# Altium schematic sheet Underground_Assembly.SchDoc: <Document>
size Letter; Engineer: <Engineer>; Organization: UPEL; Address1: USU Power Electronics Lab; Address2: USTAR Building 620, RM 118; Address3: 1600 N 620 E; Address4: North Logan, UT 84341; DocumentNumber: 11; Revision: v1; SheetNumber: 11; SheetTotal: 16; ProjectName: <Project>
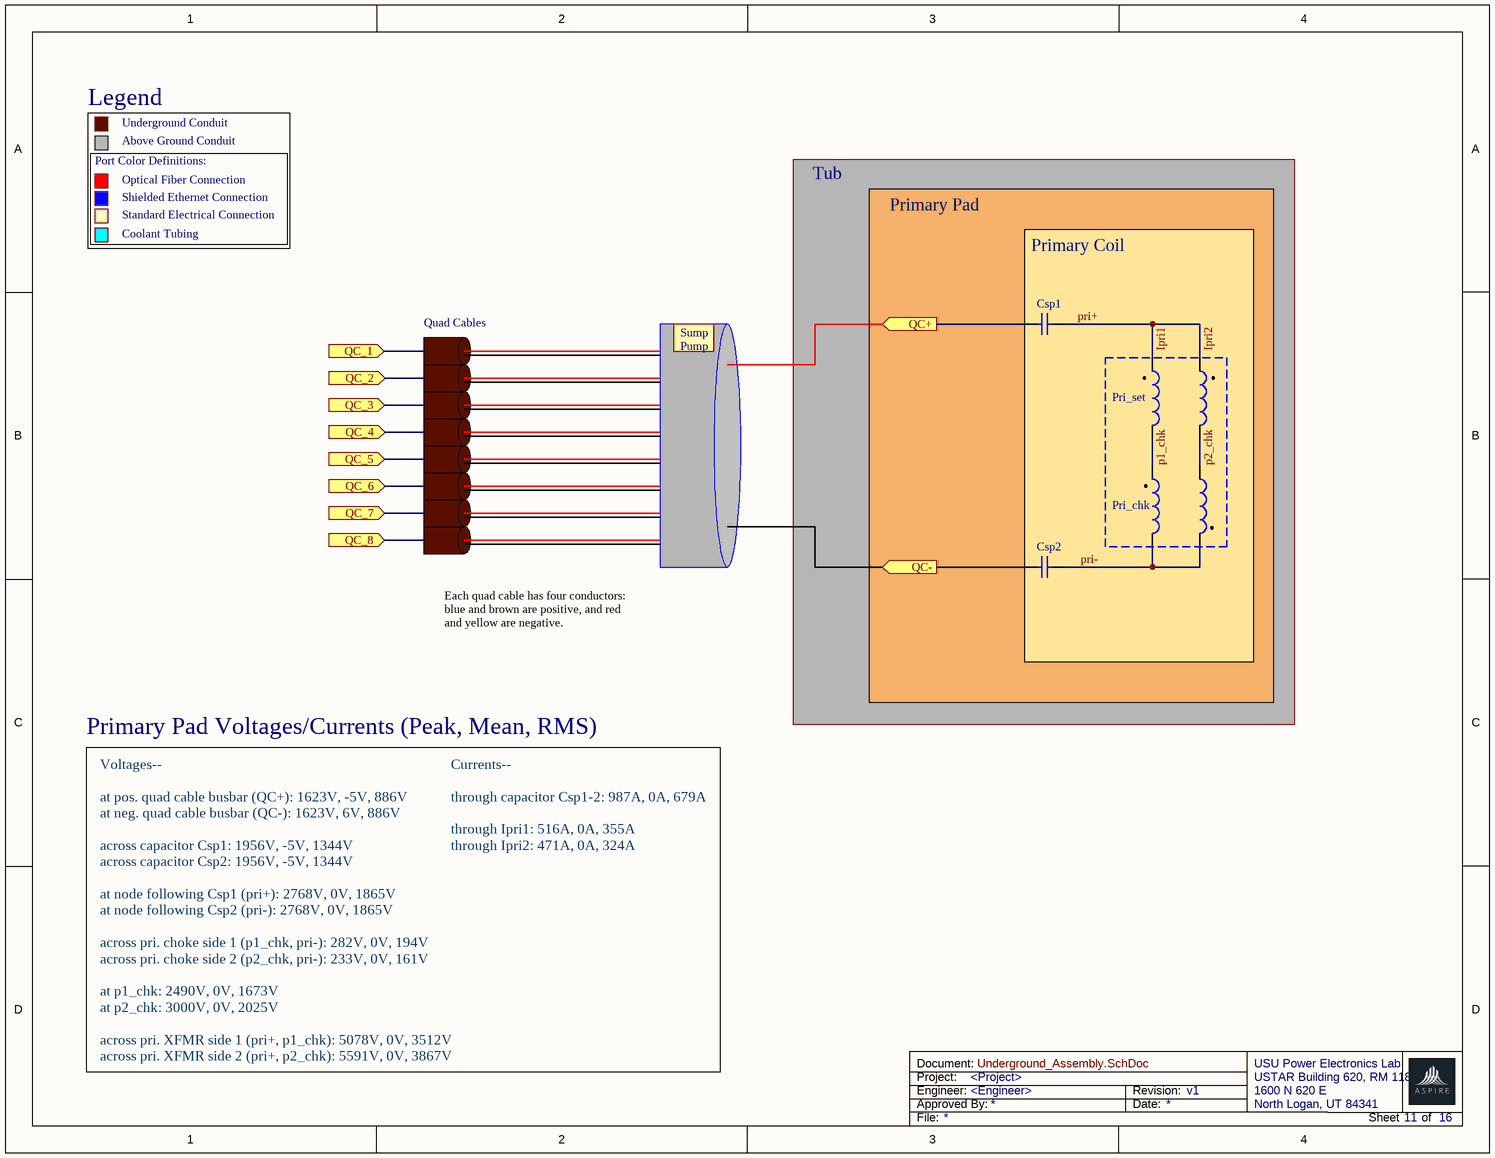
[diagram p0: Underground_Assembly.SchDoc]

## Parts
(Parts that share a designator on the sheet are numbered #1, #2 ... from top to bottom, then left to right.)
Csp1  Capacitor  (value not drawn)
Csp2  Capacitor  (value not drawn)
L?#1  Inductor  (value not drawn)
L?#2  Inductor  (value not drawn)
L?#3  Inductor  (value not drawn)
L?#4  Inductor  (value not drawn)

## Sub-sheets
Designator = File Name: no entries

## Ports
QC+ (in), QC- (in), QC_1 (in), QC_2 (in), QC_3 (in), QC_4 (in), QC_5 (in), QC_6 (in), QC_7 (in), QC_8 (in)

## Nets
Ipri1: Csp1.2 L?#1.2 L?#2.2  [also labelled Ipri2, pri+]
p1_chk: L?#1.1 L?#3.2
p2_chk: L?#2.1 L?#4.2
pri-: Csp2.2 L?#3.1 L?#4.1
QC+: Csp1.1 ; port QC+
QC-: Csp2.1 ; port QC-

## Notes on the sheet
- Legend
- Port Color Definitions:
- Underground Conduit
- Above Ground Conduit
- Optical Fiber Connection
- Shielded Ethernet Connection
- Standard Electrical Connection
- Coolant Tubing
- Tub
- Primary Pad
- Primary Coil
- Quad Cables
- Sump
  Pump
- (near L?#1) Pri_set
- (near L?#3) Pri_chk
- Each quad cable has four conductors: blue and brown are positive, and red and yellow are negative.
- Primary Pad Voltages/Currents (Peak, Mean, RMS)
- Currents--
  through capacitor Csp1-2: 987A, 0A, 679A
  through Ipri1: 516A, 0A, 355A
  through Ipri2: 471A, 0A, 324A
- Voltages--
  at pos. quad cable busbar (QC+): 1623V, -5V, 886V
  at neg. quad cable busbar (QC-): 1623V, 6V, 886V
  across capacitor Csp1: 1956V, -5V, 1344V
  across capacitor Csp2: 1956V, -5V, 1344V
  at node following Csp1 (pri+): 2768V, 0V, 1865V
  at node following Csp2 (pri-): 2768V, 0V, 1865V
  across pri. choke side 1 (p1_chk, pri-): 282V, 0V, 194V
  across pri. choke side 2 (p2_chk, pri-): 233V, 0V, 161V
  at p1_chk: 2490V, 0V, 1673V
  at p2_chk: 3000V, 0V, 2025V
  across pri. XFMR side 1 (pri+, p1_chk): 5078V, 0V, 3512V
  across pri. XFMR side 2 (pri+, p2_chk): 5591V, 0V, 3867V
- Project:
- Engineer:
- Document:
- Approved By:
- Date:
- Revision:
- File:
- Sheet
- of

## Library data of the parts
Csp1 = Capacitor: SimulationGenericComponent: True; Value: 1.66uF
Csp2 = Capacitor: SimulationGenericComponent: True; Value: 2.22uF
L?#1-L?#4 = Inductor: SimulationGenericComponent: True; Value: 1u